# EAGLE schematic alvin_skripsi v2 (EAGLE 9.7.0)
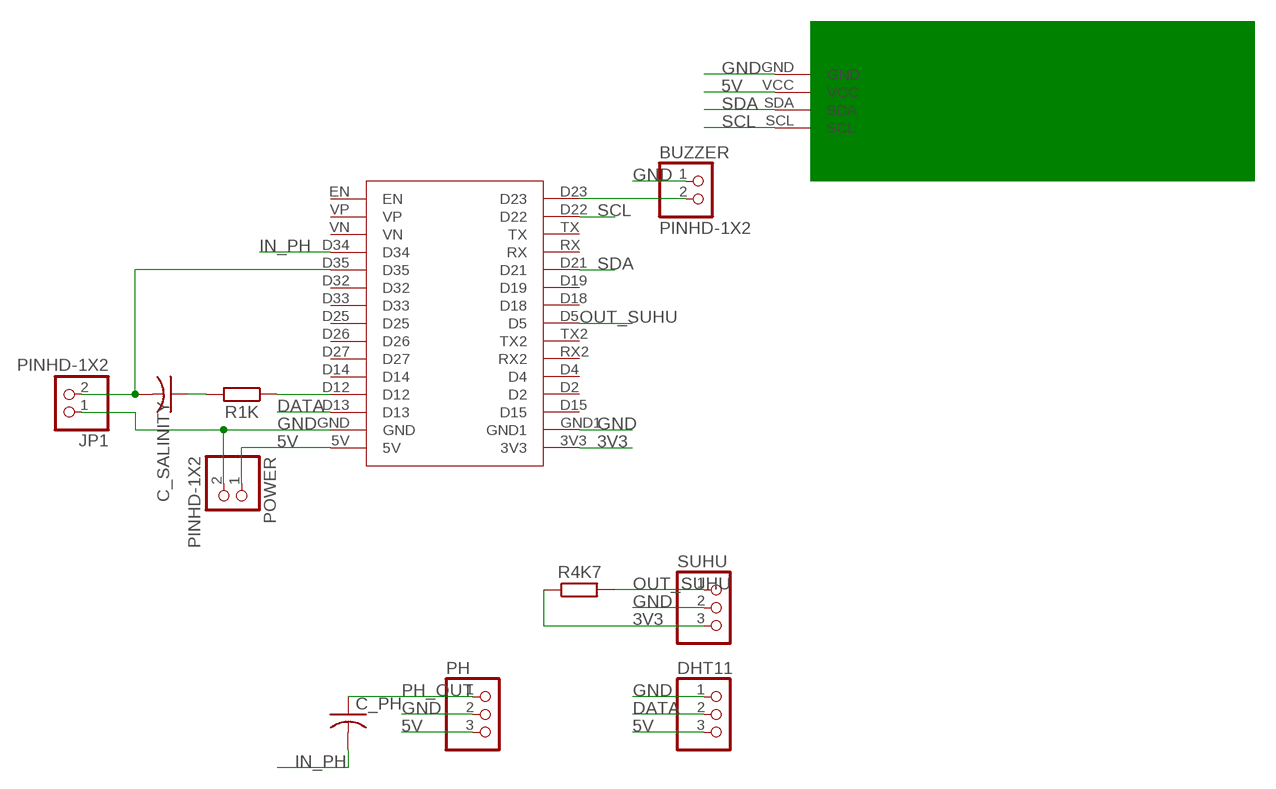
[diagram p0: schematic, sheet 1]

## Parts
BUZZER  PINHD-1X2  [1X02]
C_PH  C-US_RADIAL-12.5MM-DIA  [CAPRD550W60D1025H1250B]
C_SALINITY  C-US_RADIAL-12.5MM-DIA  [CAPRD550W60D1025H1250B]
DHT11  PINHD-1X3CB  [1X03-CLEANBIG]
JP1  PINHD-1X2  [1X02]
PH  PINHD-1X3CB  [1X03-CLEANBIG]
POWER  PINHD-1X2  [1X02]
R1K  R_AXIAL-7.2MM-PITCH  [RESAD724W46L381D178B]
R4K7  R_AXIAL-7.2MM-PITCH  [RESAD724W46L381D178B]
SUHU  PINHD-1X3CB  [1X03-CLEANBIG]
U$1  ESP32_30PIN  [ESP32_30PIN]
U$2  LCD_I2C  [LCD_I2C]

## Nets
3V3: R4K7.1 SUHU.3 U$1.3V3
5V: DHT11.3 PH.3 POWER.1 U$1.5V U$2.VCC
DATA: DHT11.2 U$1.D13
GND: BUZZER.1 DHT11.1 JP1.1 PH.2 POWER.2 SUHU.2 U$1.GND U$1.GND1 U$2.GND
IN_PH: C_PH.2 U$1.D34
N$1: R1K.1 U$1.D12
N$2: C_SALINITY.1 R1K.2
N$3: C_SALINITY.2 JP1.2 U$1.D35
N$4: BUZZER.2 U$1.D23
OUT_SUHU: R4K7.2 SUHU.1 U$1.D5
PH_OUT: C_PH.1 PH.1
SCL: U$1.D22 U$2.SCL
SDA: U$1.D21 U$2.SDA
Unconnected: U$1.D2 U$1.D4 U$1.D14 U$1.D15 U$1.D18 U$1.D19 U$1.D25 U$1.D26 U$1.D27 U$1.D32 U$1.D33 U$1.EN U$1.RX U$1.RX2 U$1.TX U$1.TX2 U$1.VN U$1.VP

## Library data of the parts
BUZZER JP1 POWER = Connector:PINHD-1X2: PIN HEADER; CATEGORY: CONNECTOR; SUB-CATEGORY: PIN-HEADER
C_PH C_SALINITY = Capacitor:C-US: Capacitor - ANSI; CATEGORY: Capacitor
DHT11 PH SUHU = adafruit:PINHD-1X3: PIN HEADER
R1K R4K7 = Resistor:R: Resistor Fixed - Generic; CATEGORY: Resistor; SUB-CATEGORY: Fixed
U$1 = FusionLocal:ESP32_30PIN
U$2 = LocalLib:LCD_I2C